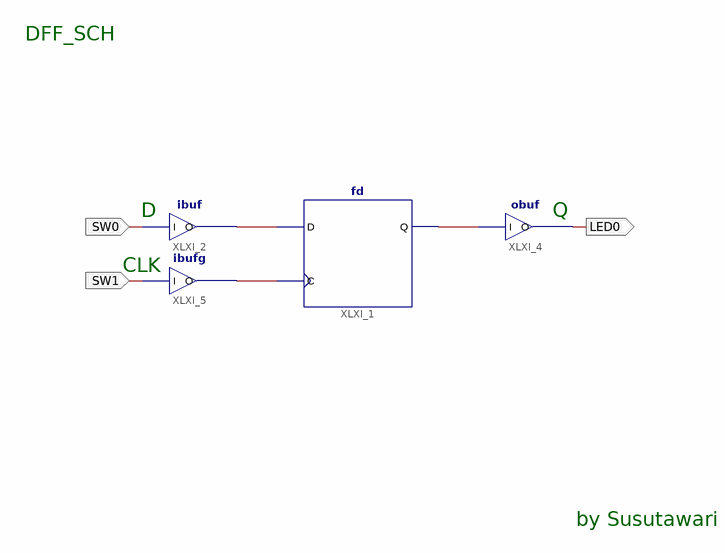
[diagram p0: schematic sheet 1]
// Xilinx ISE schematic DFF_SCH.sch (spartan3e) as structural Verilog: 4 symbols, 3 ports
module DFF_SCH (
  input  SW0,
  input  SW1,
  output LED0
);

  wire XLXN_1, XLXN_2, XLXN_3;

  fd XLXI_1 (.C(XLXN_2), .D(XLXN_1), .Q(XLXN_3));
  ibuf XLXI_2 (.I(SW0), .O(XLXN_1));
  obuf XLXI_4 (.I(XLXN_3), .O(LED0));
  ibufg XLXI_5 (.I(SW1), .O(XLXN_2));

  // Notes on the sheet:
  //   DFF_SCH
  //   D
  //   Q
  //   CLK
  //   by Susutawari
endmodule
